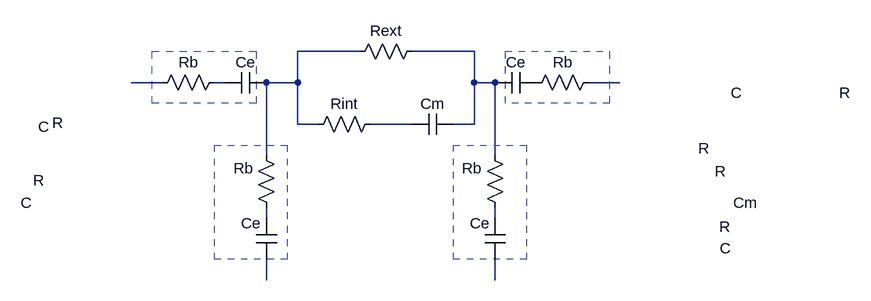
[diagram p0: schematic Modelo_de_celula.asc]
Modelo_de_celula.asc, the LTspice schematic file:
Version 4
SHEET 1 976 680
WIRE 160 80 64 80
WIRE 336 80 240 80
WIRE -144 128 -192 128
WIRE -48 128 -64 128
WIRE 64 128 64 80
WIRE 64 128 16 128
WIRE 336 128 336 80
WIRE 368 128 336 128
WIRE 560 128 512 128
WIRE 64 192 64 128
WIRE 96 192 64 192
WIRE 240 192 176 192
WIRE 336 192 336 128
WIRE 336 192 304 192
WIRE 16 240 16 128
WIRE 368 240 368 128
WIRE 16 336 16 320
WIRE 368 336 368 320
WIRE 16 432 16 400
WIRE 368 432 368 400
SYMBOL res 256 64 R90
WINDOW 0 0 56 VBottom 2
WINDOW 3 185 -459 VTop 2
SYMATTR InstName Rext
SYMBOL res 192 176 R90
WINDOW 0 0 56 VBottom 2
WINDOW 3 37 -497 VTop 2
SYMATTR InstName Rint
SYMBOL cap 304 176 R90
WINDOW 0 0 32 VBottom 2
WINDOW 3 121 -449 VTop 2
SYMATTR InstName Cm
SYMATTR Value Cm
SYMBOL res -48 112 R90
WINDOW 0 0 56 VBottom 2
WINDOW 3 62 257 VTop 2
SYMATTR InstName Rb
SYMBOL cap 16 112 R90
WINDOW 0 0 32 VBottom 2
WINDOW 3 68 343 VTop 2
SYMATTR InstName Ce
SYMBOL res 528 112 R90
WINDOW 0 0 56 VBottom 2
WINDOW 3 16 -378 VTop 2
SYMATTR InstName Rb
SYMBOL cap 432 112 R90
WINDOW 0 0 32 VBottom 2
WINDOW 3 16 -307 VTop 2
SYMATTR InstName Ce
SYMBOL res 32 336 R180
WINDOW 0 36 76 Left 2
WINDOW 3 358 58 Left 2
SYMATTR InstName Rb
SYMBOL cap 32 400 R180
WINDOW 0 24 56 Left 2
WINDOW 3 377 87 Left 2
SYMATTR InstName Ce
SYMBOL res 384 336 R180
WINDOW 0 36 76 Left 2
WINDOW 3 -346 -14 Left 2
SYMATTR InstName Rb
SYMBOL cap 384 400 R180
WINDOW 0 24 56 Left 2
WINDOW 3 -347 17 Left 2
SYMATTR InstName Ce
RECTANGLE Normal 0 160 -160 80 2
RECTANGLE Normal 48 400 -64 224 2
RECTANGLE Normal 544 160 384 80 2
RECTANGLE Normal 416 400 304 224 2

The netlist it stands for:
* Modelo_de_celula.asc
Rext N002 N001 R
Rint N006 N001 R
Cm N002 N006 Cm
Rb N004 N003 R
Ce N001 N004 C
Rb N005 P001 R
Ce P001 N002 C
Rb N007 N001 R
Ce N009 N007 C
Rb N008 N002 R
Ce N010 N008 C
.backanno
.end